# EAGLE schematic XC9572XL-CPLDbreakout-v1a (EAGLE 5.11)
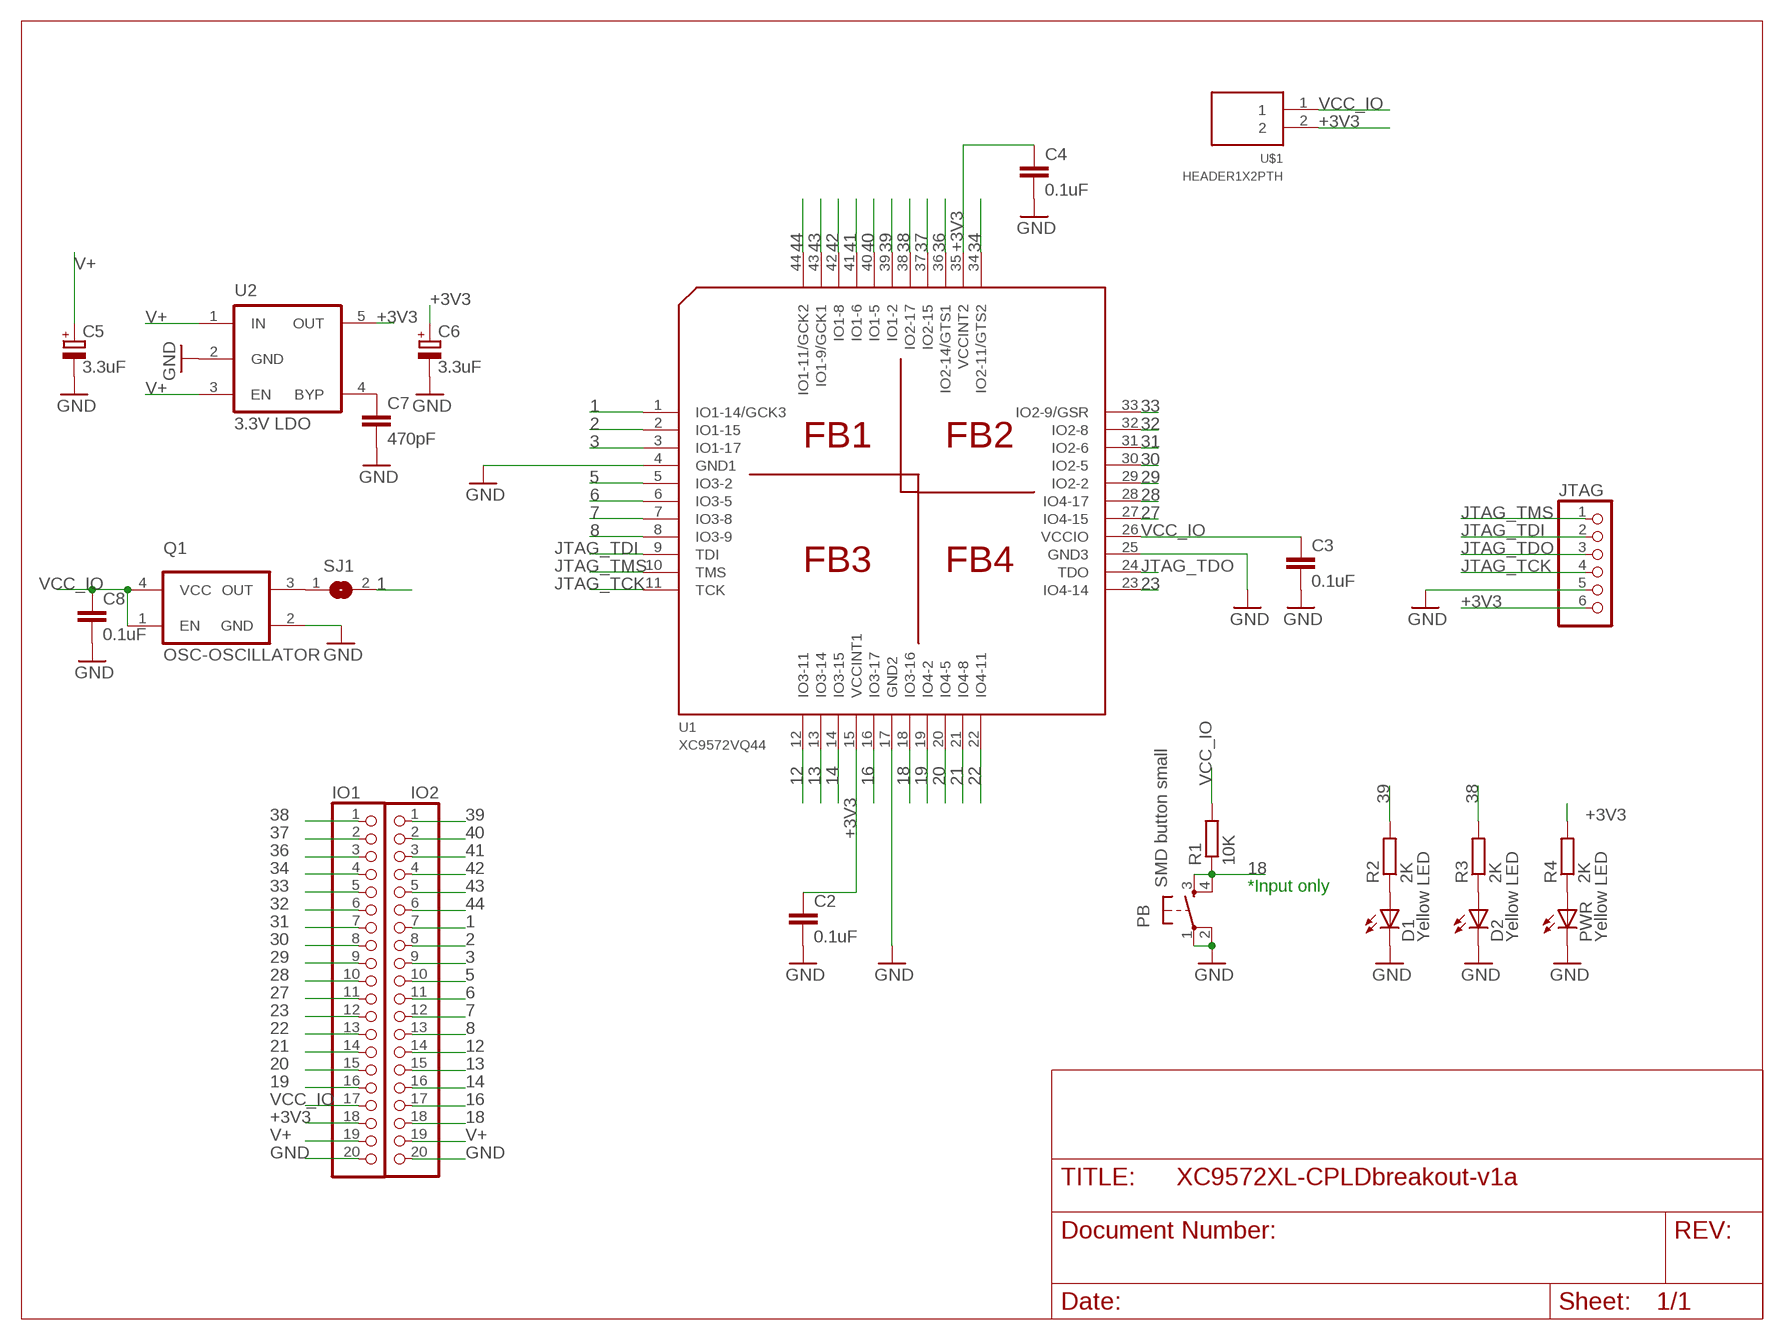
[diagram p0: schematic, sheet 1]

## Parts
C2  0.1uF  CAPC603  [C603]
C3  0.1uF  CAPC603  [C603]
C4  0.1uF  CAPC603  [C603]
C5  3.3uF  CAP_POLSMC_A  [SMC_A]
C6  3.3uF  CAP_POLSMC_A  [SMC_A]
C7  470pF  CAPC603  [C603]
C8  0.1uF  CAPC603  [C603]
D1  Yellow LED  LED805  [LED-805]
D2  Yellow LED  LED805  [LED-805]
IO1  PINHD-1X20  [1X20]
IO2  PINHD-1X20  [1X20]
JTAG  PINHD-1X6  [1X06]
PB  SMD button small  SMD_TACT_SMALL  [TACT_SWITCH_SMALL]
PWR  Yellow LED  LED805  [LED-805]
Q1  OSC-OSCILLATOR  [OSCILLATOR_7X5_SMD]
R1  10K  RESISTORR603  [R603]
R2  2K  RESISTORR603  [R603]
R3  2K  RESISTORR603  [R603]
R4  2K  RESISTORR603  [R603]
SJ1  SJ  [SJ]
U1  XC9572VQ44  [VQ44]
U2  3.3V LDO  MIC5205  [SOT-23-5]
U$1  HEADER1X2PTH  [M1X2]

## Nets
1: IO2.7 SJ1.2 U1.1(IO1-14/GCK3)
2: IO2.8 U1.2(IO1-15)
3: IO2.9 U1.3(IO1-17)
5: IO2.10 U1.5(IO3-2)
6: IO2.11 U1.6(IO3-5)
7: IO2.12 U1.7(IO3-8)
8: IO2.13 U1.8(IO3-9)
12: IO2.14 U1.12(IO3-11)
13: IO2.15 U1.13(IO3-14)
14: IO2.16 U1.14(IO3-15)
16: IO2.17 U1.16(IO3-17)
18: IO2.18 PB.3 PB.4 R1.1 U1.18(IO3-16)
19: IO1.16 U1.19(IO4-2)
20: IO1.15 U1.20(IO4-5)
21: IO1.14 U1.21(IO4-8)
22: IO1.13 U1.22(IO4-11)
23: IO1.12 U1.23(IO4-14)
27: IO1.11 U1.27(IO4-15)
28: IO1.10 U1.28(IO4-17)
29: IO1.9 U1.29(IO2-2)
30: IO1.8 U1.30(IO2-5)
31: IO1.7 U1.31(IO2-6)
32: IO1.6 U1.32(IO2-8)
33: IO1.5 U1.33(IO2-9/GSR)
34: IO1.4 U1.34(IO2-11/GTS2)
36: IO1.3 U1.36(IO2-14/GTS1)
37: IO1.2 U1.37(IO2-15)
38: IO1.1 R3.2 U1.38(IO2-17)
39: IO2.1 R2.2 U1.39(IO1-2)
40: IO2.2 U1.40(IO1-5)
41: IO2.3 U1.41(IO1-6)
42: IO2.4 U1.42(IO1-8)
43: IO2.5 U1.43(IO1-9/GCK1)
44: IO2.6 U1.44(IO1-11/GCK2)
+3V3: C2.1 C4.1 C6.+ IO1.18 JTAG.6 R4.2 U1.15(VCCINT1) U1.35(VCCINT2) U2.5(OUT) U$1.2
GND: C2.2 C3.2 C4.2 C5.- C6.- C7.2 C8.2 D1.C D2.C IO1.20 IO2.20 JTAG.5 PB.1 PB.2 PWR.C Q1.2(GND) U1.4(GND1) U1.17(GND2) U1.25(GND3) U2.2(GND)
JTAG_TCK: JTAG.4 U1.11(TCK)
JTAG_TDI: JTAG.2 U1.9(TDI)
JTAG_TDO: JTAG.3 U1.24(TDO)
JTAG_TMS: JTAG.1 U1.10(TMS)
N$1: D1.A R2.1
N$2: D2.A R3.1
N$3: PWR.A R4.1
N$4: C7.1 U2.4(BYP)
N$5: Q1.3(OUT) SJ1.1
V+: C5.+ IO1.19 IO2.19 U2.1(IN) U2.3(EN)
VCC_IO: C3.1 C8.1 IO1.17 Q1.1(EN) Q1.4(VCC) R1.2 U1.26(VCCIO) U$1.1

## Notes on the sheet
- *Input only

## Library data of the parts
C2-C4 C7 C8 = dp_devices:CAP
C5 C6 = dp_devices:CAP_POL
D1 D2 PWR = dp_devices:LED
IO1 IO2 = pinhead:PINHD-1X20: PIN HEADER
JTAG = pinhead:PINHD-1X6: PIN HEADER
PB = dp_devices:SMD_TACT_SMALL
Q1 = dp_devices:OSC-OSCILLATOR: Oscillator
R1-R4 = dp_devices:RESISTOR
SJ1 = jumper:SJ: SMD solder JUMPER
U1 = dp_devices:XC9572
U2 = dp_devices:MIC5205: 150ma Low-Noise LDO Regulator
U$1 = dp_devices:HEADER1X2